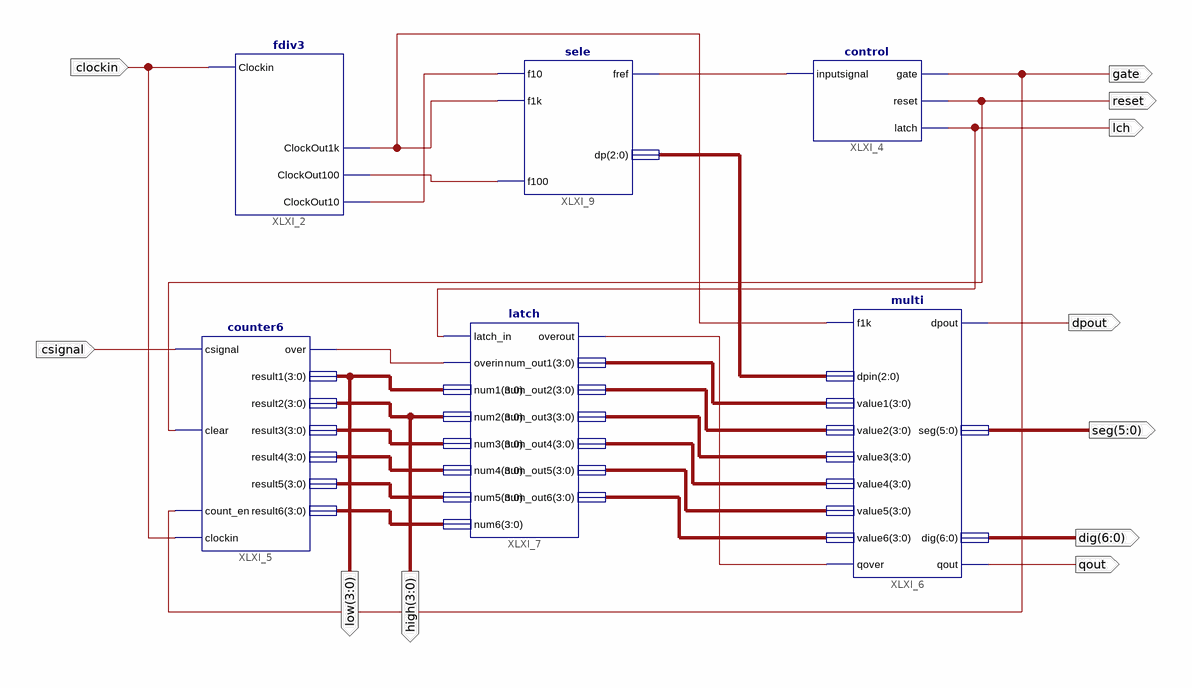
[diagram p0: schematic sheet 1]
// Xilinx ISE schematic ce_top.sch (spartan6) as structural Verilog: 6 symbols, 11 ports
module ce_top (
  input  clockin,
  input  csignal,
  output gate,
  output reset,
  output [3:0] low,
  output dpout,
  output [5:0] seg,
  output [6:0] dig,
  output qout,
  output lch,
  output [3:0] high
);

  wire XLXN_2, XLXN_3, XLXN_4, XLXN_7, XLXN_13, XLXN_48;
  wire [2:0] XLXN_6;
  wire [3:0] XLXN_16, XLXN_17, XLXN_22, XLXN_23, XLXN_24, XLXN_25, XLXN_26, XLXN_27, XLXN_49, XLXN_50;

  fdiv3 XLXI_2 (.Clockin(clockin), .ClockOut1k(XLXN_2), .ClockOut100(XLXN_4), .ClockOut10(XLXN_3));
  control XLXI_4 (.inputsignal(XLXN_7), .gate(gate), .reset(reset), .latch(lch));
  counter6 XLXI_5 (
    .csignal(csignal), .clear(reset), .count_en(gate), .over(XLXN_13), .result1(low), .result2(high),
    .result3(XLXN_16), .result4(XLXN_17), .result5(XLXN_49), .result6(XLXN_50), .clockin(clockin));
  multi XLXI_6 (
    .f1k(XLXN_2), .qover(XLXN_48), .dpin(XLXN_6), .value1(XLXN_22), .value2(XLXN_23), .value3(XLXN_24),
    .value4(XLXN_25), .value5(XLXN_26), .value6(XLXN_27), .qout(qout), .dpout(dpout), .seg(seg), .dig(dig));
  latch XLXI_7 (
    .latch_in(lch), .overin(XLXN_13), .num1(low), .num2(high), .num3(XLXN_16), .num4(XLXN_17),
    .num5(XLXN_49), .num6(XLXN_50), .overout(XLXN_48), .num_out1(XLXN_22), .num_out2(XLXN_23),
    .num_out3(XLXN_24), .num_out4(XLXN_25), .num_out5(XLXN_26), .num_out6(XLXN_27));
  sele XLXI_9 (.f1k(XLXN_2), .f100(XLXN_4), .f10(XLXN_3), .fref(XLXN_7), .dp(XLXN_6));
endmodule
